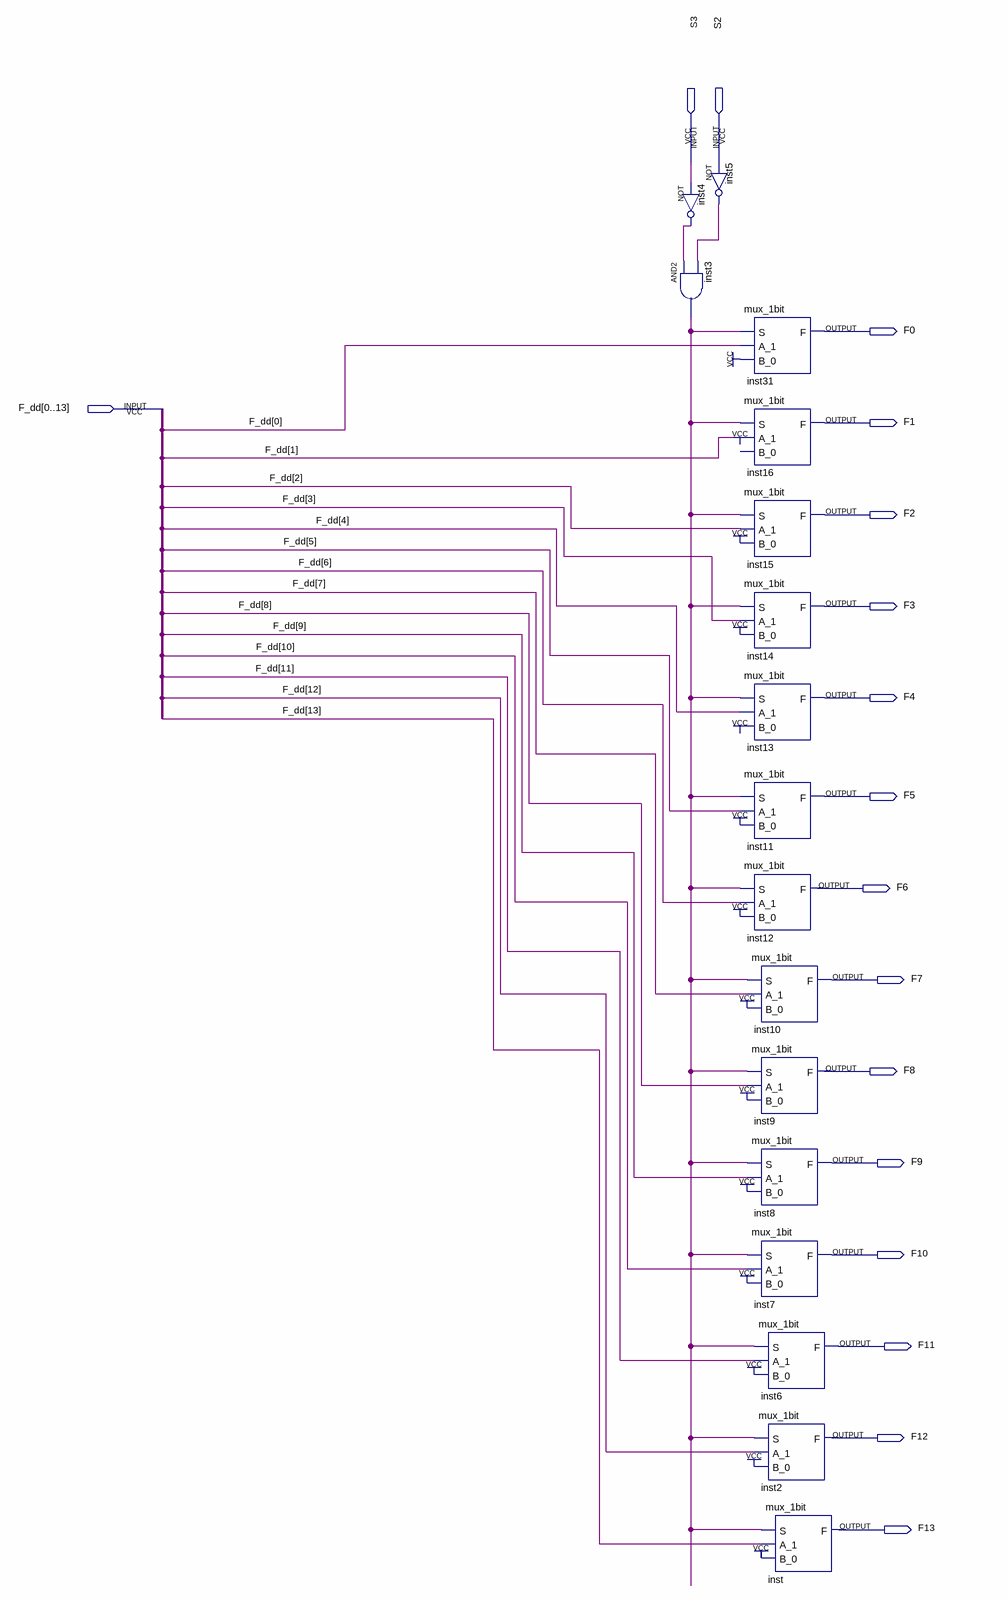
[diagram p0: schematic sheet]
// Quartus schematic MUX_d.bdf as structural Verilog: 17 symbols, 17 pins
module MUX_d (
  input  S3,
  input  S2,
  input  [0:13] F_dd,
  output F0,
  output F1,
  output F2,
  output F3,
  output F4,
  output F5,
  output F6,
  output F7,
  output F8,
  output F9,
  output F10,
  output F11,
  output F12,
  output F13
);

  wire inst3_out, inst4_out, inst5_out;

  not inst4 (inst4_out, S3);
  and inst3 (inst3_out, inst4_out, inst5_out);
  not inst5 (inst5_out, S2);
  mux_1bit inst31 (.S(inst3_out), .A_1(F_dd[0]), .B_0(1'b1), .F(F0));
  mux_1bit inst16 (.S(inst3_out), .A_1(F_dd[1]), .F(F1));  // open: B_0
  mux_1bit inst15 (.S(inst3_out), .A_1(F_dd[2]), .B_0(1'b1), .F(F2));
  mux_1bit inst14 (.S(inst3_out), .A_1(F_dd[3]), .B_0(1'b1), .F(F3));
  mux_1bit inst13 (.S(inst3_out), .A_1(F_dd[4]), .F(F4));  // open: B_0
  mux_1bit inst11 (.S(inst3_out), .A_1(F_dd[5]), .B_0(1'b1), .F(F5));
  mux_1bit inst12 (.S(inst3_out), .A_1(F_dd[6]), .B_0(1'b1));  // open: F
  mux_1bit inst10 (.S(inst3_out), .A_1(F_dd[7]), .B_0(1'b1), .F(F7));
  mux_1bit inst9 (.S(inst3_out), .A_1(F_dd[8]), .B_0(1'b1));  // open: F
  mux_1bit inst8 (.S(inst3_out), .A_1(F_dd[9]), .B_0(1'b1), .F(F9));
  mux_1bit inst7 (.S(inst3_out), .A_1(F_dd[10]), .B_0(1'b1), .F(F10));
  mux_1bit inst6 (.S(inst3_out), .A_1(F_dd[11]), .B_0(1'b1), .F(F11));
  mux_1bit inst2 (.S(inst3_out), .A_1(F_dd[12]), .B_0(1'b1));  // open: F
  mux_1bit inst (.S(inst3_out), .A_1(F_dd[13]), .B_0(1'b1));  // open: F
endmodule
